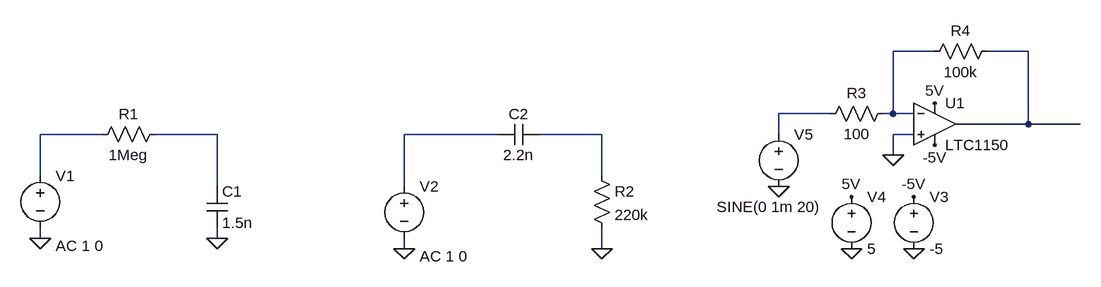
[diagram p0: schematic Week_2_Quiz.asc]
Week_2_Quiz.asc, the LTspice schematic file:
Version 4
SHEET 1 1604 680
WIRE 1376 0 1312 0
WIRE 1520 0 1456 0
WIRE 1216 96 1136 96
WIRE 1312 96 1312 0
WIRE 1312 96 1296 96
WIRE 1344 96 1312 96
WIRE 1520 112 1520 0
WIRE 1520 112 1408 112
WIRE 1600 112 1520 112
WIRE 96 128 0 128
WIRE 272 128 176 128
WIRE 704 128 560 128
WIRE 864 128 768 128
WIRE 1136 128 1136 96
WIRE 1344 128 1312 128
WIRE 1312 160 1312 128
WIRE 0 192 0 128
WIRE 864 192 864 128
WIRE 272 208 272 128
WIRE 560 208 560 128
WIRE 0 288 0 272
WIRE 272 288 272 272
WIRE 560 304 560 288
WIRE 864 304 864 272
FLAG 272 288 0
FLAG 0 288 0
FLAG 864 304 0
FLAG 560 304 0
FLAG 1248 304 0
FLAG 1136 208 0
FLAG 1344 304 0
FLAG 1312 160 0
FLAG 1344 224 -5V
FLAG 1376 144 -5V
FLAG 1248 224 5V
FLAG 1376 80 5V
SYMBOL voltage 0 176 R0
WINDOW 123 24 124 Left 2
WINDOW 39 0 0 Left 0
SYMATTR InstName V1
SYMATTR Value ""
SYMATTR Value2 AC 1 0
SYMBOL res 192 112 R90
WINDOW 0 0 56 VBottom 2
WINDOW 3 32 56 VTop 2
SYMATTR InstName R1
SYMATTR Value 1Meg
SYMBOL cap 256 208 R0
SYMATTR InstName C1
SYMATTR Value 1.5n
SYMBOL voltage 560 192 R0
WINDOW 123 24 124 Left 2
WINDOW 39 0 0 Left 0
SYMATTR InstName V2
SYMATTR Value ""
SYMATTR Value2 AC 1 0
SYMBOL cap 768 112 R90
WINDOW 0 0 32 VBottom 2
WINDOW 3 32 32 VTop 2
SYMATTR InstName C2
SYMATTR Value 2.2n
SYMBOL res 848 176 R0
SYMATTR InstName R2
SYMATTR Value 220k
SYMBOL OpAmps\\LTC1150 1376 48 R0
SYMATTR InstName U1
SYMBOL voltage 1344 208 R0
WINDOW 123 0 0 Left 0
WINDOW 39 0 0 Left 0
SYMATTR InstName V3
SYMATTR Value -5
SYMBOL voltage 1248 208 R0
WINDOW 123 0 0 Left 0
WINDOW 39 0 0 Left 0
SYMATTR InstName V4
SYMATTR Value 5
SYMBOL voltage 1136 112 R0
WINDOW 3 -95 128 Left 2
WINDOW 123 0 0 Left 0
WINDOW 39 0 0 Left 0
SYMATTR InstName V5
SYMATTR Value SINE(0 1m 20)
SYMBOL res 1312 80 R90
WINDOW 0 0 56 VBottom 2
WINDOW 3 32 56 VTop 2
SYMATTR InstName R3
SYMATTR Value 100
SYMBOL res 1472 -16 R90
WINDOW 0 0 56 VBottom 2
WINDOW 3 32 56 VTop 2
SYMATTR InstName R4
SYMATTR Value 100k

The netlist it stands for:
* Week_2_Quiz.asc
V1 N004 0 AC 1 0
R1 N005 N004 1Meg
C1 N005 0 1.5n
V2 N006 0 AC 1 0
C2 N007 N006 2.2n
R2 N007 0 220k
XU1 0 N001 5V -5V N002 LTC1150  ; pins In+ In- V+ V- OUT
V3 -5V 0 -5
V4 5V 0 5
V5 N003 0 SINE(0 1m 20)
R3 N001 N003 100
R4 N002 N001 100k
.lib LTC.lib
.backanno
.end